# Altium schematic sheet Bagryanets_2.SchDoc
size 420 x 297 mm; SheetNumber: 2; SheetTotal: 2; ListNumber: 2; DocumentCode: МГТУ.464415.001 Э3
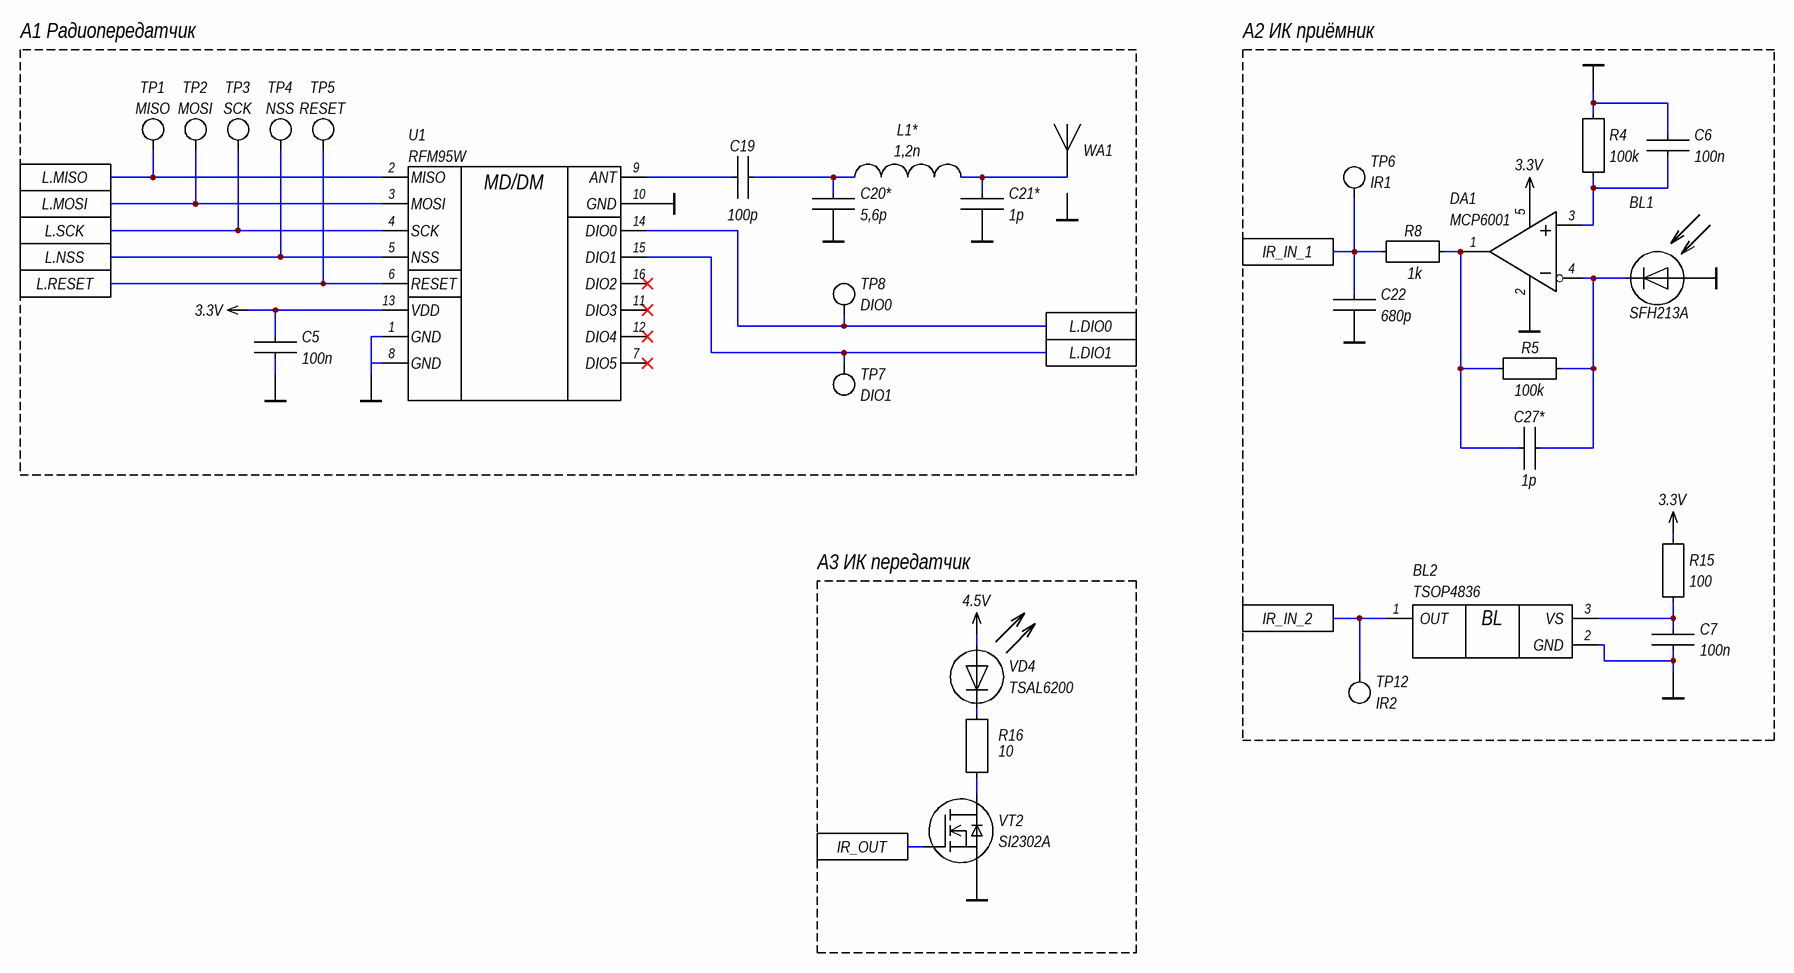
[diagram p0: Bagryanets_2.SchDoc]

## Parts
BL1  SFH213A  [LED_5mm]
BL2  TSOP4836  [TO92_TSOP4836_Horizontal]
C5  100n  [CAP: 0603]
C6  100n  [CAP: 0603]
C7  100n  [CAP: 0603]
C19  100p  [CAP: 0402]
C20*  5,6p  [CAP: 0402]
C21*  1p  [CAP: 0402]
C22  680p  [CAP: 0603]
C27*  1p  [CAP: 0603]
DA1  MCP6001  [SOT23-5]
L1*  1,2n  [IND: 0402]
R4  100k  [RES: 0603]
R5  100k  [RES: 0603]
R8  1k  [RES: 0603]
R15  100  [RES: 0603]
R16  10  [RES: 0603]
TP1  MISO  [Testpoint_1mm]
TP2  MOSI  [Testpoint_1mm]
TP3  SCK  [Testpoint_1mm]
TP4  NSS  [Testpoint_1mm]
TP5  RESET  [Testpoint_1mm]
TP6  IR1  [Testpoint_1mm]
TP7  DIO1  [Testpoint_1mm]
TP8  DIO0  [Testpoint_1mm]
TP12  IR2  [Testpoint_1mm]
U1  RFM95W  [Module_RFM95W]
VD4  TSAL6200  [LED_5mm]
VT2  SI2302A  [SOT23]
WA1  Antenna  [WA-Lora868]  (value not drawn)

## Blocks framed on the sheet
А1 Радиопередатчик: C5 C19 C20* C21* L1* TP1-TP5 TP7 TP8 U1 WA1
А2 ИК приёмник: BL1 BL2 C6 C7 C22 C27* DA1 R4 R5 R8 R15 TP6 TP12
А3 ИК передатчик: R16 VD4 VT2

## Ports
IR_IN_1 (see Bagryanets[5K]), IR_IN_2 (see Bagryanets[5K]), IR_OUT (see Bagryanets[5J]), L.DIO0 (see Bagryanets[2L]), L.DIO1 (see Bagryanets[2K]), L.MISO (see Bagryanets[3L]), L.MOSI (see Bagryanets[3K]), L.NSS (see Bagryanets[3K]), L.RESET (see Bagryanets[3K]), L.SCK (see Bagryanets[3K])

## Nets
3.3V: C5.2 DA1.5(VDD) R15.1 U1.13(VDD)
4.5V: VD4.A
GND: BL1.A BL2.2(GND) C5.1 C6.2 C7.1 C20*.1 C21*.1 C22.1 DA1.2(VSS) R4.1 U1.1(GND) U1.8(GND) U1.10(GND) VT2.2(S) WA1.2
IR_IN_1: C22.2 R8.1 TP6.1 ; port IR_IN_1
IR_IN_2: BL2.1(OUT) TP12.1 ; port IR_IN_2
IR_OUT: VT2.1(G) ; port IR_OUT
L.DIO0: TP8.1 U1.14(DIO0) ; port L.DIO0
L.DIO1: TP7.1 U1.15(DIO1) ; port L.DIO1
L.MISO: TP1.1 U1.2(MISO) ; port L.MISO
L.MOSI: TP2.1 U1.3(MOSI) ; port L.MOSI
L.NSS: TP4.1 U1.5(NSS) ; port L.NSS
L.RESET: TP5.1 U1.6(RESET) ; port L.RESET
L.SCK: TP3.1 U1.4(SCK) ; port L.SCK
NetBL1_C: BL1.C C27*.2 DA1.4(VIN-) R5.2
NetBL2_3: BL2.3(VS) C7.2 R15.2
NetC6_1: C6.1 DA1.3(VIN+) R4.2
NetC19_1: C19.1 C20*.2 L1*.1
NetC19_2: C19.2 U1.9(ANT)
NetC21*_2: C21*.2 L1*.2 WA1.1
NetC27*_1: C27*.1 DA1.1(VOUT) R5.1 R8.2
NetR16_1: R16.1 VD4.C
NetR16_2: R16.2 VT2.3(D)

Not connected (* = marked no-connect by the designer): U1 7(DIO5)* 11(DIO3)* 12(DIO4)* 16(DIO2)*

## Notes on the sheet
- Подп. и дата
- Инв. № дубл.
- Взам. инв. №
- Инв. № подл.
- Изм.
- Лист
- № докум.
- Подп.
- Дата
- Копировал
- Формат А3
- (in symbol BL-TSOP4836) BL
- (in symbol MOD-RFM95W) MD/DM

## Library data of the parts
BL1 = BL-Photodiod
BL2 = BL-TSOP4836
C5-C7 C19 C20* C21* C22 C27* = C-Capacitor
DA1 = DA-MCP6001UT-I/OT: IC OPAMP GP 1 CIRCUIT SOT23-5; Number of Amplifiers: 1; Voltage: 6V; Power Supply Rejection Ratio (PSRR): 86dB; Common Mode Rejection Ratio: 60dB; Unity Gain Bandwidth Product: 1MHz; Slew Rate: 0.6V/µs; Output Current per Channel: 23mA; Nominal Supply Current: 100uA; Input Offset Voltage (Vos): 4.5mV; Input Bias Current: 1pA; Operating Supply Voltage: 5.5V; Min Supply Voltage: 1.8V; Voltage Gain: 112dB; Length: 3.1mm; REACH SVHC: No SVHC; Number of Pins: 5; Package Quantity: 1; Radiation Hardening: No; Mount: Surface Mount; Number of Circuits: 1; Number of Elements: 1; Output Current: 23mA; Packaging: Tape and Reel; Height: 1.3mm; Lead Free: Lead Free; Min Operating Temperature: -40°C; Bandwidth: 1MHz; Contact Plating: Tin; Max Supply Voltage: 6V; Max Operating Temperature: 85°C; Width: 1.8mm; Case/Package: SOT-23; Operating Supply Current: 100uA; Number of Channels: 1; Gain Bandwidth Product: 1MHz
L1* = L-Inductor
R4 R5 R8 R15 R16 = R-Resistor
TP1-TP8 TP12 = TP-Testpoint
U1 = MOD-RFM95W: Rfm95W LoRa Transceiver Module 868Mhz; Sensitivity: -123dBm; Current - Receiving: 12.1mA; Current - Transmitting: 120mA; Max Supply Voltage: 3.7V; Min Supply Voltage: 1.8V; Nominal Supply Current: 5.8mA; Number of GPIO: 6NUMBER; ComponentLink1Description: Manufacturer URL; ComponentLink2Description: Datasheet; ComponentLink1URL: http://www.st.com/web/en/home.html; ComponentLink3URL: http://www.st.com/st-web-ui/static/active/en/resource/technical/document/datasheet/DM00058181.pdf; ComponentLink2URL: http://www.st.com/st-web-ui/static/active/en/resource/technical/document/datasheet/CD00161566.pdf; ComponentLink3Description: Package Specification; Clock Frequency: 868MHz; Height: 1.8mm; ComponentLink4URL: https://www.rfsolutions.co.uk/downloads/1463993415RFM95_96_97_98W.pdf?src-supplier=Digikey; ComponentLink4Description: https://www.rfsolutions.co.uk/downloads/1463993415RFM95_96_97_98W.pdf?src-supplier=Digikey
VD4 = HL-LED
VT2 = VT-N-FET-GSD
WA1 = WA-Antenna_2pin